# Altium schematic sheet IP.SchDoc
size A4; SheetNumber: 6; SheetTotal: 14
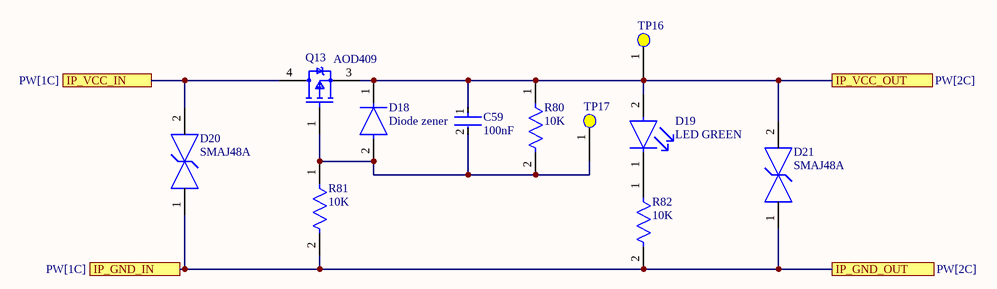
[diagram p0: IP.SchDoc]

## Parts
C59  100nF  [FP-GRM18-0_15-MFG]
D18  Diode zener  [FP-DO-213AA-MFG]
D19  LED GREEN  [FP-LTST-C190GKT-MFG]
D20  SMAJ48A  [FP-SMAJ-MFG]
D21  SMAJ48A  [FP-SMAJ-MFG]
Q13  AOD409  [FP-PG-TO252-3-MFG]
R80  10K  [FP-RC0603-0_55-IPC_A]
R81  10K  [FP-RC0603-0_55-IPC_C]
R82  10K  [FP-RC0603-0_55-IPC_C]
TP16  Test Point  [Test Point]  (value not drawn)
TP17  Test Point  [Test Point]  (value not drawn)

## Ports
IP_GND_IN (see PW[1C]), IP_GND_OUT (see PW[2C]), IP_VCC_IN (see PW[1C]), IP_VCC_OUT (see PW[2C])

## Nets
IP_GND_IN: D20.1 D21.1 R81.2 R82.2 ; port IP_GND_IN, port IP_GND_OUT
IP_VCC_IN: D20.2 Q13.4(D) ; port IP_VCC_IN
IP_VCC_OUT: C59.1 D18.1(C) D19.2(A) D21.2 Q13.3(S) R80.1 TP16.1(Test_Point) ; port IP_VCC_OUT
NetC59_2: C59.2 D18.2(A) Q13.1(G) R80.2 R81.1 TP17.1(Test_Point)
NetD19_1: D19.1(C) R82.1

## Library data of the parts
C59 = CMP-2000-05448-2: CAP CER 10V X5R 0603; Manufacturer Part Number: GRM188R61A106KE69D; Manufacturer: Murata; Temperature Coefficient: 15%; Value: 10uF; Material: Ceramic; Tolerance: 10%; Device Class L1: Passive Components; ComponentLink2Description: Datasheet; Height: 0.95mm; Package: GRM18-0.15; Octopart: https://octopart.com/grm188r61a106ke69d-murata-22851381; Digikey Description: CAP CER 10UF 10V X5R 0603; Temperature Range High: +85°C; Temperature Range Low: -55°C; Temperature Characteristic: X5R; Capacitance: 10uF; RoHS: TRUE; Device Class L2: Capacitors; ComponentLink2URL: https://search.murata.co.jp/Ceramy/image/img/A01X/G101/ENG/GRM188R61A106KE69-01A.pdf; Device Class L3: Ceramic Capacitors; Lead Free: Yes; Mouser Description: Multilayer Ceramic Capacitors MLCC - SMD/SMT 0603 10uF 10volts X5R + - 10%; Category: Cap; Voltage Rating: 10V; Temperature: -55°C to +85°C; Automotive: No
D18 = CMP-2000-07607-2: ZMM12 Diode zener 0.5W 12V SOD-80(1206); Manufacturer Part Number: JANTX1N4148UR-1; Manufacturer: Microsemi; Max Junction Temp: +175°C; Max Repetitive Reverse Voltage: 75V; Value: 4pF; Reverse Voltage: 100V; Forward Current: 200mA; Max Surge Forward Current: 2A; Temperature: -65°C to +175°C; Device Class L2: Diodes; Capacitance: 4pF; Octopart: https://octopart.com/jantx1n4148ur-1-microsemi-6804654; Height: 1.7mm; Automotive: No; Digikey Description: DIODE GEN PURP 75V 200MA DO213AA; Device Class L1: Discrete Semiconductors; Package: DO-213AA; Category: Diode; ComponentLink2URL: https://www.microsemi.com/document-portal/doc_download/125215-lds-0281-1-datasheet; Device Class L3: Rectifier Diodes; Temperature Range Low: -65°C; Temperature Range High: +175°C; Mouser Description: Diodes - General Purpose, Power, Switching Switching; RoHS: FALSE; Lead Free: No; ComponentLink2Description: Datasheet
D19 = CMP-22017-000005-2: LED GREEN CLEAR CHIP SMD; Dominant Wavelength: 569nm; Reverse Voltage: 5V; Lens Color: Colorless; Viewing Angle: 130°; Voltage: 2V; Forward Current: 30mA; Power Dissipation: 100mW; Luminous Intensity: 6mcd; Number of LEDs: 1; Forward Voltage: 2.1V; Wavelength: 565nm; Test Current: 10mA; Min Operating Temperature: -55°C; Lens Style: Clear; Mount: Surface Mount; Width: 0.8mm; Packaging: Tape and Reel; Lens Transparency: Clear; Case Code (Metric): 1608; Depth: 0.8mm; Case Code (Imperial): 0603; Case/Package: 0603; Number of Pins: 2; Max Operating Temperature: 85°C; Lead Free: Lead Free; Number of Elements: 1; Length: 1.6mm; Height: 0.8mm; Package Quantity: 1; Power Rating: 100mW; Radiation Hardening: No; Illumination Color: Green; Color: Green
D20 D21 = CMP-08607-000067-1: SMAJ48A TVS DIODE 48VWM 77.4VC DO214AC (SMA); Manufacturer: Littelfuse Inc; Manufacturer Part Number: SMAJ58CA; Reverse Standoff Voltage: 58V; Breakdown Voltage: 64.4V; Peak Pulse Current: 4.3A; Peak Pulse Power: 400W; Direction: Bidirectional; Clamping Voltage: 93.6V; Number Of Channels: 1; Max Junction Temp: +150°C; Device Class L2: TVS Diodes; ComponentLink2Description: Datasheet; Lead Free: Yes; Height: 2.29mm; Automotive: No; Package: SMAJ; Digikey Description: TVS DIODE 58V 93.6V DO214AC; Temperature Range Low: -65°C; Device Class L1: Circuit Protection; Temperature Range High: +150°C; Mouser Description: In a Pack of 25, Littelfuse SMAJ58CA, Bi-Directional TVS Diode, 400W, 2-Pin DO-214AC; Octopart: https://octopart.com/smaj58ca-littelfuse-350202; ComponentLink2URL: https://www.littelfuse.com/~/media/electronics/datasheets/tvs_diodes/littelfuse_tvs_diode_smaj_datasheet.pdf.pdf; Temperature: -65°C to +150°C; Device Class L3: unset; Category: Diode; RoHS: TRUE
Q13 = CMP-32901-000090-1: AOD409 MOSFET P-CH 60V 26A TO252; Manufacturer: Infineon; Manufacturer Part Number: IRFR5410TRPBF; Threshold Vgs Min: -2V; Pulse Drain Current: -52A; Max Junction Temp: +150°C; Drain To Source Voltage: -100V; Max Forward Diode Voltage: -1.6V; Power Dissipation: 66W; Turn On Delay Time: 15ns; Input Capacitace At Vds: 760pF @ -25V; Rthja Max: 50°C/W; Depletion Mode: False; Number Of P Channels: 1; Reverse Recovery Time: 130ns; Continuous Drain Current: -13A; Drain To Source Resistance: 0.205Ω; Threshold Vgs Max: -4V; Reverse Recovery Charge: 650nC; Gate To Source Voltage: 20V; Gate Charge At Vgs: 58nC @ -10V; Turn Off Delay Time: 45ns; Temperature: -55°C to +150°C; Package: PG-TO252-3; Category: Trans; Footprint Url: http://www.irf.com/package/hexfet/dpakfootprint.pdf; Temperature Range Low: -55°C; Temperature Range High: +150°C; Automotive: No; Device Class L3: MOSFETs; Digikey Description: MOSFET P-CH 100V 13A DPAK; ComponentLink2URL: https://www.infineon.com/dgdl/irfr5410pbf.pdf?fileId=5546d462533600a4015356356f622107; Octopart: https://octopart.com/irfr5410trpbf-infineon-65874169; Device Class L2: Transistors; Lead Free: Yes; ComponentLink2Description: Datasheet; Height: 2.52mm; Number Of Channels: 1; Drain To Source Breakdown Voltage: -100V; Device Class L1: Discrete Semiconductors; RoHS: TRUE
R80-R82 = CMP-2100-03664-2: RES 10K OHM 1% 1/10W 0603; Voltage Rating: 75V; Voltage Rating (DC): 50V; Resistance: 10kR; Power Rating: 100mW; Temperature Coefficient: 100ppm/°C; Depth: 0.8mm; Termination: SMD/SMT; Resistor Type: Thick Film; Series: RC; Construction: Rectangular; Features: Moisture Resistant; Packaging: Tape and Reel; Min Operating Temperature: -55°C; Number of Terminations: 2; Lead Pitch: 0.3mm; RoHS Compliant: Yes; Case/Package: 0603; Resistance Tolerance: 1%; Military Standard: Not; Weight: 7.1E-05oz; Number of Pins: 2; Tolerance: 1%; Length: 1.6mm; Case Code (Imperial): 0603; Lead Free: Lead Free; Width: 0.8mm; Max Power Dissipation: 100mW; Height: 0.45mm; Max Operating Temperature: 155°C; Case Code (Metric): 1608; Size Code: 0603